# Altium schematic sheet Custom_MCU.SchDoc
size A; SheetNumber: 5; SheetTotal: 8
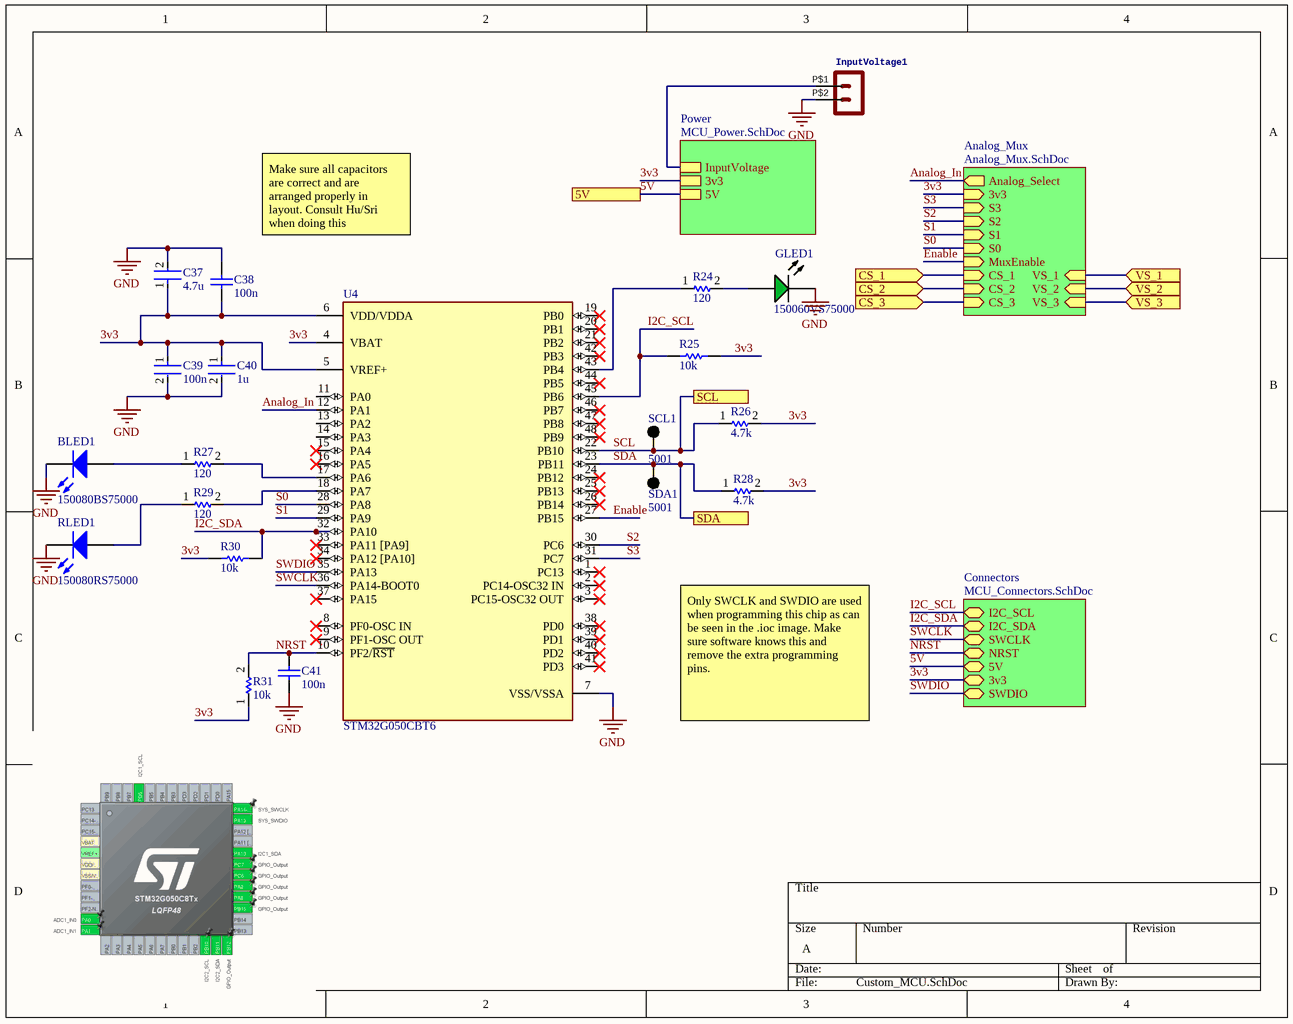
[diagram p0: Custom_MCU.SchDoc]

## Parts
BLED1  150080BS75000  [0805_A]
C37  4.7u  [FP-CL282-IPC_C]
C38  100n  [CAPC1050X55X23ML05T13]
C39  100n  [FP-CL10-0_1-MFG]
C40  1u  [FP-CL542-IPC_C]
C41  100n  [CAPC1050X55X23ML05T13]
GLED1  150060VS75000  [WE-150060VS75000_V]
InputVoltage1  Molex - Micro-Fit 3.0 Series connector,  3.00mm (0.118") pitch header, 2 positions.  [44914-0201]  (value not drawn)
R24  120  [0402WGF1200TCE]
R25  10k  [RESC1609X55X30LL15T15]
R26  4.7k  [0402WGF4701TCE]
R27  120  [0402WGF1200TCE]
R28  4.7k  [0402WGF4701TCE]
R29  120  [0402WGF1200TCE]
R30  10k  [RESC1609X55X30LL15T15]
R31  10k  [0402WGF1002TCE]
RLED1  150080RS75000  [0805_A]
SCL1  5001  [KSTN-5001]
SDA1  5001  [KSTN-5001]
U4  STM32G050CBT6  [FP-LQFP48-5B-MFG]

## Sub-sheets
Analog_Mux = Analog_Mux.SchDoc: CS_3 (in), Analog_Select (out), S0 (in), S2 (in), S1 (in), CS_1 (in), CS_2 (in), MuxEnable (in), S3 (in), VS_2 (in), VS_1 (in), VS_3 (in), 3v3 (in)
Connectors = MCU_Connectors.SchDoc: SWCLK (bidir), NRST (bidir), 5V (bidir), SWDIO (bidir), 3v3 (bidir), I2C_SCL (bidir), I2C_SDA (bidir)
Power = MCU_Power.SchDoc: InputVoltage, 5V, 3v3

## Ports
5V, CS_1 (in), CS_2 (in), CS_3 (in), SCL, SDA, VS_1 (in), VS_2 (in), VS_3 (in)

## Nets
GND: BLED1.1(K) C37.2 C38.1 C39.2 C40.2 C41.1 GLED1.1(K) InputVoltage1.P$2 RLED1.1(K) U4.7(VSS/VSSA)
3v3: C37.1 C38.2 C39.1 C40.1 R25.1 R26.2 R28.2 R30.1 R31.1 U4.4(VBAT) U4.5(VREF+) U4.6(VDD/VDDA) ; sheet Analog_Mux/3v3, sheet Power/3v3, sheet Connectors/3v3
5V: port 5V, sheet Power/5V, sheet Connectors/5V
Analog_In: U4.12(PA1) ; sheet Analog_Mux/Analog_Select
CS_1: port CS_1, sheet Analog_Mux/CS_1
CS_2: port CS_2, sheet Analog_Mux/CS_2
CS_3: port CS_3, sheet Analog_Mux/CS_3
Enable: U4.27(PB15) ; sheet Analog_Mux/MuxEnable
I2C_SCL: R25.2 U4.45(PB6) ; sheet Connectors/I2C_SCL
I2C_SDA: R30.2 U4.32(PA10) ; sheet Connectors/I2C_SDA
NRST: C41.2 R31.2 U4.10(PF2/~{RST}) ; sheet Connectors/NRST
S0: U4.28(PA8) ; sheet Analog_Mux/S0
S1: U4.29(PA9) ; sheet Analog_Mux/S1
S2: U4.30(PC6) ; sheet Analog_Mux/S2
S3: U4.31(PC7) ; sheet Analog_Mux/S3
SCL: R26.1 SCL1.1 U4.22(PB10) ; port SCL
SDA: R28.1 SDA1.1 U4.23(PB11) ; port SDA
SWCLK: U4.36(PA14-BOOT0) ; sheet Connectors/SWCLK
SWDIO: U4.35(PA13) ; sheet Connectors/SWDIO
VS_1: port VS_1, sheet Analog_Mux/VS_1
VS_2: port VS_2, sheet Analog_Mux/VS_2
VS_3: port VS_3, sheet Analog_Mux/VS_3
NetBLED1_2: BLED1.2(A) R27.1
NetGLED1_2: GLED1.2(A) R24.2
NetInputVoltage1_P$1: InputVoltage1.P$1 ; sheet Power/InputVoltage
NetR24_1: R24.1 U4.43(PB4)
NetR27_2: R27.2 U4.17(PA6)
NetR29_1: R29.1 RLED1.2(A)
NetR29_2: R29.2 U4.18(PA7)

Not connected (* = marked no-connect by the designer): U4 1(PC13)* 2(PC14-OSC32_IN)* 3(PC15-OSC32_OUT)* 8(PF0-OSC_IN)* 9(PF1-OSC_OUT)* 11(PA0) 13(PA2) 14(PA3) 15(PA4)* 16(PA5)* 19(PB0)* 20(PB1)* 21(PB2)* 24(PB12)* 25(PB13)* 26(PB14)* 33(PA11_[PA9])* 34(PA12_[PA10])* 37(PA15)* 38(PD0)* 39(PD1)* 40(PD2)* 41(PD3)* 42(PB3)* 44(PB5)* 46(PB7)* 47(PB8)* 48(PB9)*

## Notes on the sheet
- Make sure all capacitors are correct and are arranged properly in layout. Consult Hu/Sri when doing this
- Only SWCLK and SWDIO are used when programming this chip as can be seen in the .ioc image. Make sure software knows this and remove the extra programming pins.

## Library data of the parts
BLED1 = CMP-1426-00008-1: SMD mono-color Chip LED, WL-SMCW, Blue; Manufacturer: Wuerth Elektronik; Color: Blue; ComponentLink2URL: http://katalog.we-online.com/led/datasheet/150080BS75000.pdf; ComponentLink1URL: http://www.we-online.com; ComponentLink2Description: Datasheet; PackageReference: 0805_A; ComponentLink1Description: Manufacturer URL; PartNumber: 150080BS75000
C37 = CMP-13271-000548-1: Cap Ceramic 4.7uF 10V X5R ±20% SMD 0402 +85°C Paper T/R; Assembled: yes; Capacitance: 4.7uF; Max Operating Temperature: 85°C; Lead Free: Lead Free; Tolerance: 20%; Voltage Rating: 10V; Dielectric: X5R; Width: 0.02inch; Length: 0.039inch; Case/Package: 0402; Min Operating Temperature: -55°C; Packaging: Tape and Reel; Thickness: 0.022inch; Case Code (Imperial): 0402; Package Quantity: 10000; Case Code (Metric): 1005; Mount: Surface Mount; Distributor: JLCPCB; JLCPCB Part Number: C23733
C38 C41 = CMP-2000-05439-1: Chip Capacitor, 100 nF, +/- 10%, 16 V, -55 to 125 degC, 0402 (1005 Metric), RoHS, Tape and Reel; Manufacturer: Samsung Electro-Mechanics; Capacitance: 100000pF; Dielectric: X7R; Rated Voltage: 16V; Assembled: yes; Case Size/Dimension: 0402; Tolerance (%): ±10%; Manufacturer URL: http://www.samsungsem.com/global/index.jsp; Datasheet URL: https://datasheet.ciiva.com/29198/458718-da-01-en-vs-kondensator-0402-29198423.pdf; Datasheet Version: Nov-10; Distributor: JLCPCB; JLCPCB Part Number: C1525
C39 = CMP-13271-000011-1: CAP CER 0.1UF 50V X7R 0603; Manufacturer: Samsung Electro-Mechanics America, Inc; Manufacturer Part Number: CL10B104JB8NNNC; Value: 100nF; Material: Ceramic; Temperature Coefficient: 15%; Tolerance: 5%; Ipc Land Pattern Name: CAPC16080X80; Device Class L1: Passive Components; Digikey Description: CAP CER 0.1UF 50V X7R 0603; Voltage Rating: 50V; Height: 0.9mm; ComponentLink2Description: Datasheet; Device Class L2: Capacitors; ComponentLink2URL: http://www.samsungsem.com/kr/support/product-search/mlcc/__icsFiles/afieldfile/2019/06/18/CL10B104JB8NNNC-19.pdf; Temperature Characteristic: X7R; Temperature Range High: +125°C; Lead Free: Yes; Temperature Range Low: -55°C; Category: Cap; Package: CL10-0.1; Temperature: -55°C to +125°C; Octopart: https://octopart.com/cl10b104jb8nnnc-samsung-9302151; Device Class L3: Ceramic Capacitors; RoHS: TRUE; Automotive: No; Capacitance: 100nF
C40 = CMP-13271-001051-1: Cap Ceramic 1uF 25V X5R ±10% SMD 0402 +85°C Paper T/R; Assembled: yes; Radiation Hardening: No; Lead Free: Lead Free; Capacitance: 1uF; Package Quantity: 10000; Max Operating Temperature: 85°C; Voltage Rating: 25V; Case/Package: 0402; Min Operating Temperature: -55°C; Packaging: Tape and Reel; Tolerance: 10%; Height: 0.5mm; Thickness: 0.022inch; Case Code (Metric): 1005; Width: 0.02inch; Case Code (Imperial): 0402; Dielectric: X5R; Length: 1mm; Mount: Surface Mount; Material: Ceramic; Depth: 0.5mm; Distributor: JLCPCB; JLCPCB Part Number: C52923
GLED1 = CMP-1426-00006-4: WL-SMCW SMD Chip LED Top View Monocolor Waterclear, 30 mA, 2 V, -40 to 85 degC, 2-Pin SMD, RoHS, Tape and Reel; DatasheetVersion: Rev. 2.7; PackageDescription: 2-Pin Surface Mount Device, Body 1.6 x 0.8 mm; ComponentLink1URL: https://www.we-online.com/; PartNumber: 150060VS75000; RoHSCompliant: True; ComponentLink2URL: http://katalog.we-online.de/led/datasheet/150060VS75000.pdf; ComponentLink1Description: Manufacturer URL; Mounting Technology: Surface Mount; ComponentLink2Description: Datasheet
InputVoltage1 = HEADER_POS2_?44914-0201: GateName_1: G$1; SymbolName_1: HEADER_POS2; DeviceName: 44914-0201; LibraryName: con-molex-micro-fit-3_0_2; DeviceSetName: HEADER_POS2_?; Package: 44914-0201
R24 R27 R29 = 0402WGF1200TCE: ±1% 1/16W ±100ppm/℃ 120Ω 0402 Chip Resistor - Surface Mount ROHS; Manufacturer: UNI-ROYAL; Assembled: yes; Manufacturer Part Number: 0402WGF1200TCE; Distributor: JLCPCB; Price: $0.0015; JLCPCB Part Number: C25079
R25 R30 = CMP-1012-00623-3: Chip Resistor, 10 KOhm, +/- 1%, 0.1 W, -55 to 155 degC, 0603 (1608 Metric), RoHS, Tape and Reel; Manufacturer: Panasonic; Voltage Rating: 75V; Case\/Package: 0603; Power Rating: 100mW; Resistance: 10KOhm; Temperature Coefficient: 100ppm\/degreesC; Number of Pins: 2; Package Reference: 603; Depth: 0.8mm; Mount: SurfaceMount; Package Description: 2-Pin Surface Mount Device, Body 1.6 x 0.85 mm; Datasheet Version: 02/2017; Length: 1.6mm; Lead Free: LeadFree; Height: 0.45mm; Number of Terminations: 2; Max Power Dissipation: 100mW; Min Operating Temperature: -55degC; Datasheet URL: https://industrial.panasonic.com/cdbs/www-data/pdf/RDA0000/AOA0000C304.pdf; Termination: SMD/SMT; Case Code (Metric): 1608; Case Code (Imperial): 0603; Tolerance: 1%; Max Operating Temperature: 155degC; RoHSCompliant: true; Voltage Rating (DC): 75V; Radiation Hardening: No; Packaging: TapeandReel; Composition: ThickFilm; Mounting Technology: SurfaceMount; Manufacturer URL: http://www.panasonic.com/; Width: 0.031inch; REACH SVHC: NoSVHC; Contact Plating: Tin; Military Standard: Not; Package Quantity: 1
R26 R28 = 0402WGF4701TCE: 1/16W ±1% 4.7kΩ ±100ppm/℃ 0402 Chip Resistor - Surface Mount ROHS; Manufacturer: UNI-ROYAL; Assembled: yes; Manufacturer Part Number: 0402WGF4701TCE; Distributor: JLCPCB; Price: $0.0015; JLCPCB Part Number: C25900
R31 = 0402WGF1002TCE: 1/16W ±1% ±100ppm/℃ 10kΩ 0402 Chip Resistor - Surface Mount ROHS; Manufacturer: UNI-ROYAL; Assembled: yes; Manufacturer Part Number: 0402WGF1002TCE; Distributor: JLCPCB; Price: $0.0012; JLCPCB Part Number: C25744
RLED1 = CMP-1426-00011-1: SMD mono-color Chip LED, WL-SMCW, Red; Manufacturer: Wuerth Elektronik; Color: Red; PartNumber: 150080RS75000; PackageReference: 0805_A; ComponentLink2Description: Datasheet; ComponentLink1URL: http://www.we-online.com; ComponentLink1Description: Manufacturer URL; ComponentLink2URL: http://katalog.we-online.com/led/datasheet/150080RS75000.pdf
SCL1 SDA1 = CMP-2000-05181-1: Test Point, Black, 1-Pin THD, RoHS, Bulk; Manufacturer: Keystone; Other Names: 5001K; Catalog Drawings: 5000Series; Alternate Color: 5004K-ND / -TESTPOINTPCMINI.040"DYELLOW / 5003K-ND / -TESTPOINTPCMINI.040"DORANGE / 5002K-ND / -TESTPOINTPCMINI.040"DWHITE / 5000K-ND / -TESTPOINTPCMINI.040"DRED; Kits: DKTGRS232C-KIT-ND / -TTLCONVERTER; Online Catalog: ColorCodedTestPoints; Datasheet URL: https://ciiva.com/datasheet-click-2917627?src=ciiva&sig=bd195616; Mounting Type: 0.040"(1.02mm)HoleDiameter; Family: TestPoints; RoHS Information: RoHSComplianceStatement; Datasheet Version: Rev. G, 12/2008; Color: Black; Category: TestandMeasurement; Standard Package: 100; Manufacturer URL: http://www.keyelco.com/; Material: Base,Nylon46,UL94V-0; Type: PCTestPoint,Miniature; Terminal: 0.010"x0.020"(0.25mmx0.51mm)PhosphorBronzeWire,SilverPlated; Series: THM; Packaging: Bulk
U4 = CMP-12105-000052-1: IC MCU 32BIT 128KB FLASH 48LQFP; Manufacturer: STMicroelectronics; Manufacturer Part Number: STM32G071CBT6; Max Junction Temp: +105°C; Number Of I2C Channels: 2; Number Of Adc Channels: 17; Frequency: 64MHz; Memory Size: 128KBytes; Interface: I2C,SPI,UART,USART,USB,LIN,IrDA,I2S,Other; Ram Size: 36KBytes; Min Supply Voltage: 1.55V; Number Of Cores: 1; Max Supply Voltage: 3.6V; Core Architecture: ARM Cortex-M0+; Standoff Height: 0.05mm; Number Of Timers/Counters: 12; Number Of I/Os: 44; Data Bus Width: 32bits; Number Of Uart Channels: 5; Temperature Range Low: -40°C; Package: LQFP48-5B; Lead Free: Yes; Temperature Range High: +85°C; Octopart: https://octopart.com/stm32g071cbt6-stmicroelectronics-96627027; Ambient Temperature Range Low: -40°C; Automotive: No; Device Class L1: Integrated Circuits (ICs); Height: 1.6mm; ComponentLink2URL: https://www.st.com/resource/en/datasheet/stm32g071cb.pdf; Number Of Usb Channels: 2; Device Class L3: Microcontrollers; ComponentLink2Description: Datasheet; Number Of Spi Channels: 2; Memory Type: FLASH; Device Class L2: Embedded Processors and Controllers; Digikey Description: IC MCU 32BIT 128KB FLASH 48LQFP; Ambient Temperature Range High: +85°C; Category: IC; Number Of A/D Converters: 1; RoHS: TRUE; Temperature: -40°C to +85°C